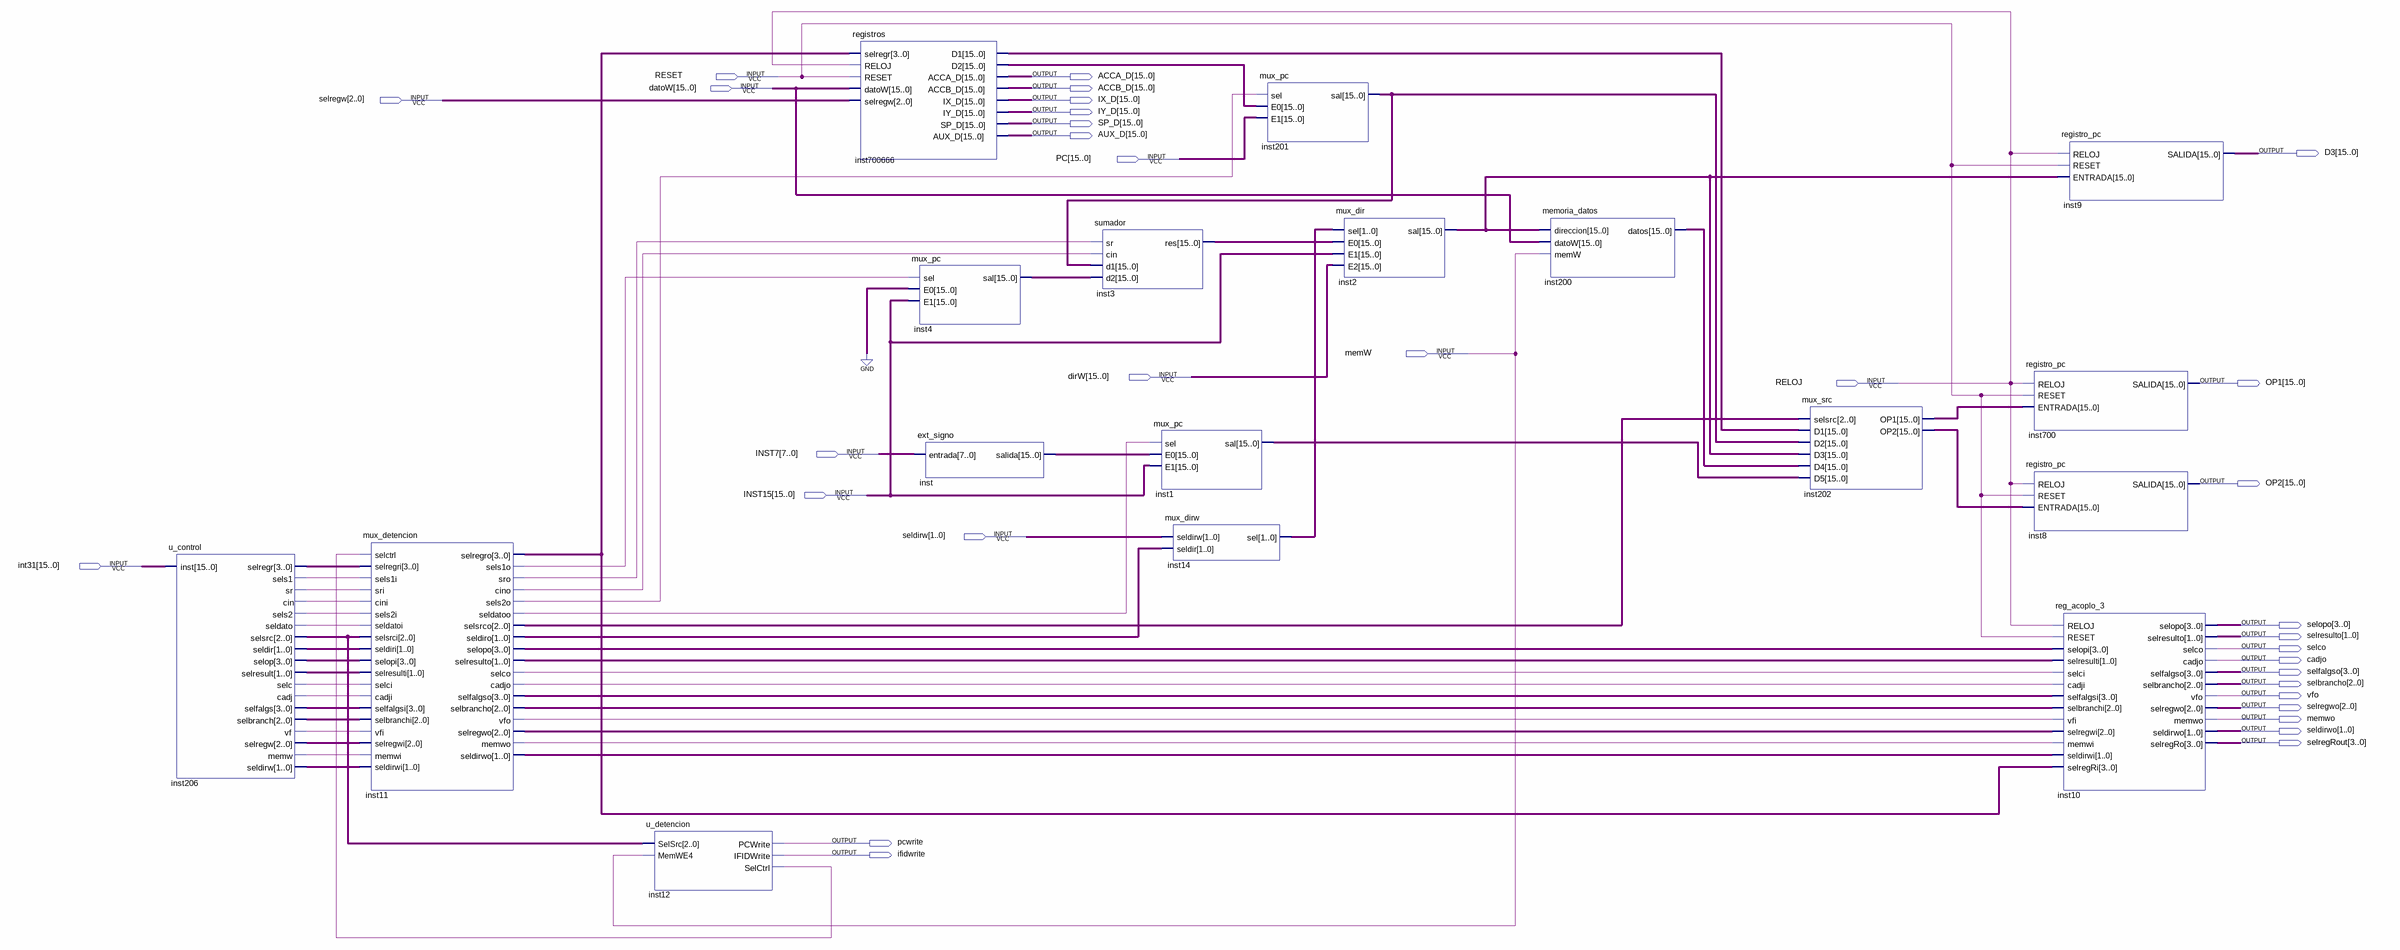
[diagram p0: schematic sheet]
// Quartus schematic etapa2.bdf as structural Verilog: 17 symbols, 33 pins
module etapa2 (
  input  RESET,
  input  [15:0] datoW,
  input  [2:0] selregw,
  input  [15:0] PC,
  input  memW,
  input  [15:0] dirW,
  input  RELOJ,
  input  [7:0] INST7,
  input  [15:0] INST15,
  input  [1:0] seldirw,
  input  [15:0] int31,
  output [15:0] ACCA_D,
  output [15:0] ACCB_D,
  output [15:0] IX_D,
  output [15:0] IY_D,
  output [15:0] SP_D,
  output [15:0] AUX_D,
  output [15:0] D3,
  output [15:0] OP1,
  output [15:0] OP2,
  output [3:0] selopo,
  output [1:0] selresulto,
  output selco,
  output cadjo,
  output [3:0] selfalgso,
  output [2:0] selbrancho,
  output vfo,
  output [2:0] selregwo,
  output memwo,
  output [1:0] seldirwo,
  output [3:0] selregRout,
  output pcwrite,
  output ifidwrite
);

  wire inst11_cadjo, inst11_cino, inst11_memwo, inst11_selco, inst11_seldatoo, inst11_sels1o, inst11_sels2o,
       inst11_sro, inst11_vfo, inst12_selctrl, inst206_cadj, inst206_cin, inst206_memw, inst206_selc,
       inst206_seldato, inst206_sels1, inst206_sels2, inst206_sr, inst206_vf;
  wire [1:0] inst11_seldiro, inst11_seldirwo, inst11_selresulto, inst14_sel, inst206_seldir, inst206_seldirw,
       inst206_selresult;
  wire [2:0] inst11_selbrancho, inst11_selregwo, inst11_selsrco, inst206_selbranch, inst206_selregw,
       inst206_selsrc;
  wire [3:0] inst11_selfalgso, inst11_selopo, inst11_selregro, inst206_selfalgs, inst206_selop,
       inst206_selregr;
  wire [15:0] inst1_sal, inst2_sal, inst3_res, inst4_sal, inst200_datos, inst201_sal, inst202_op1,
       inst202_op2, inst700666_d1, inst700666_d2, inst_salida;

  u_control inst206 (
    .inst(int31), .selregr(inst206_selregr), .sels1(inst206_sels1), .sr(inst206_sr), .cin(inst206_cin),
    .sels2(inst206_sels2), .seldato(inst206_seldato), .selsrc(inst206_selsrc), .seldir(inst206_seldir),
    .selop(inst206_selop), .selresult(inst206_selresult), .selc(inst206_selc), .cadj(inst206_cadj),
    .selfalgs(inst206_selfalgs), .selbranch(inst206_selbranch), .vf(inst206_vf), .selregw(inst206_selregw),
    .memw(inst206_memw), .seldirw(inst206_seldirw));
  mux_detencion inst11 (
    .selctrl(inst12_selctrl), .selregri(inst206_selregr), .sels1i(inst206_sels1), .sri(inst206_sr),
    .cini(inst206_cin), .sels2i(inst206_sels2), .seldatoi(inst206_seldato), .selsrci(inst206_selsrc),
    .seldiri(inst206_seldir), .selopi(inst206_selop), .selresulti(inst206_selresult), .selci(inst206_selc),
    .cadji(inst206_cadj), .selfalgsi(inst206_selfalgs), .selbranchi(inst206_selbranch), .vfi(inst206_vf),
    .selregwi(inst206_selregw), .memwi(inst206_memw), .seldirwi(inst206_seldirw), .selregro(inst11_selregro),
    .sels1o(inst11_sels1o), .sro(inst11_sro), .cino(inst11_cino), .sels2o(inst11_sels2o),
    .seldatoo(inst11_seldatoo), .selsrco(inst11_selsrco), .seldiro(inst11_seldiro), .selopo(inst11_selopo),
    .selresulto(inst11_selresulto), .selco(inst11_selco), .cadjo(inst11_cadjo), .selfalgso(inst11_selfalgso),
    .selbrancho(inst11_selbrancho), .vfo(inst11_vfo), .selregwo(inst11_selregwo), .memwo(inst11_memwo),
    .seldirwo(inst11_seldirwo));
  u_detencion inst12 (
    .SelSrc(inst206_selsrc), .MemWE4(memW), .PCWrite(pcwrite), .IFIDWrite(ifidwrite), .SelCtrl(inst12_selctrl));
  registros inst700666 (
    .selregr(inst11_selregro), .RELOJ(RELOJ), .RESET(RESET), .datoW(datoW), .selregw(selregw),
    .D1(inst700666_d1), .D2(inst700666_d2), .ACCA_D(ACCA_D), .ACCB_D(ACCB_D), .IX_D(IX_D), .IY_D(IY_D),
    .SP_D(SP_D), .AUX_D(AUX_D));
  mux_pc inst4 (.sel(inst11_sels1o), .E0({16{1'b0}}), .E1(INST15), .sal(inst4_sal));
  ext_signo inst (.entrada(INST7), .salida(inst_salida));
  sumador inst3 (.sr(inst11_sro), .cin(inst11_cino), .d1(inst201_sal), .d2(inst4_sal), .res(inst3_res));
  mux_pc inst1 (.sel(inst11_seldatoo), .E0(inst_salida), .E1(INST15), .sal(inst1_sal));
  mux_dirw inst14 (.seldirw(seldirw), .seldir(inst11_seldiro), .sel(inst14_sel));
  mux_pc inst201 (.sel(inst11_sels2o), .E0(inst700666_d2), .E1(PC), .sal(inst201_sal));
  mux_dir inst2 (.sel(inst14_sel), .E0(inst3_res), .E1(INST15), .E2(dirW), .sal(inst2_sal));
  memoria_datos inst200 (.direccion(inst2_sal), .datoW(datoW), .memW(memW), .datos(inst200_datos));
  mux_src inst202 (
    .selsrc(inst11_selsrco), .D1(inst700666_d1), .D2(inst201_sal), .D3(inst2_sal), .D4(inst200_datos),
    .D5(inst1_sal), .OP1(inst202_op1), .OP2(inst202_op2));
  registro_pc inst700 (.RELOJ(RELOJ), .RESET(RESET), .ENTRADA(inst202_op1), .SALIDA(OP1));
  registro_pc inst8 (.RELOJ(RELOJ), .RESET(RESET), .ENTRADA(inst202_op2), .SALIDA(OP2));
  registro_pc inst9 (.RELOJ(RELOJ), .RESET(RESET), .ENTRADA(inst2_sal), .SALIDA(D3));
  reg_acoplo_3 inst10 (
    .RELOJ(RELOJ), .RESET(RESET), .selopi(inst11_selopo), .selresulti(inst11_selresulto),
    .selci(inst11_selco), .cadji(inst11_cadjo), .selfalgsi(inst11_selfalgso), .selbranchi(inst11_selbrancho),
    .vfi(inst11_vfo), .selregwi(inst11_selregwo), .memwi(inst11_memwo), .seldirwi(inst11_seldirwo),
    .selregRi(inst11_selregro), .selopo(selopo), .selresulto(selresulto), .selco(selco), .cadjo(cadjo),
    .selfalgso(selfalgso), .selbrancho(selbrancho), .vfo(vfo), .selregwo(selregwo), .memwo(memwo),
    .seldirwo(seldirwo), .selregRo(selregRout));
endmodule
